# EAGLE design RFID_bmd200 (EAGLE 7.5.0)

## Sheet 1 of 2
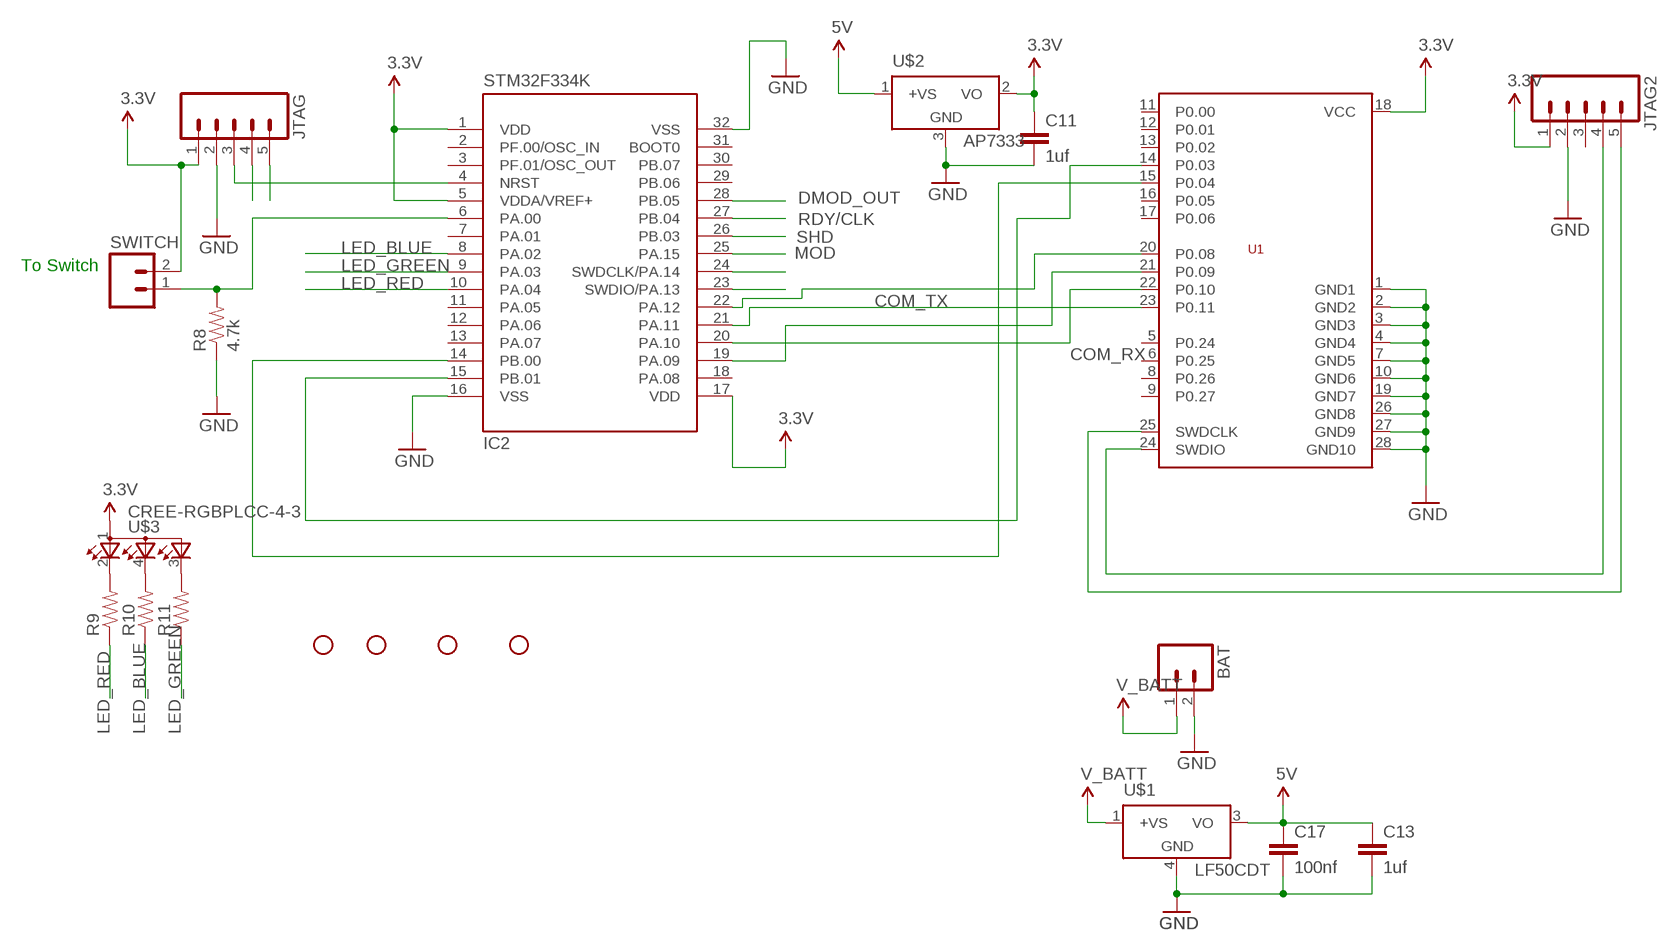
[diagram p0: schematic, sheet 1]

### Parts
BAT  M02PTH  [1X02]
C11  1uf  CAP0805  [0805]
C13  1uf  CAP0805  [0805]
C17  100nf  CAP0805  [0805]
IC2  STM32F334K  [LQFP-32]
JTAG  M05PTH  [1X05]
JTAG2  M05PTH  [1X05]
R8  4.7k  RESISTOR0805-RES  [0805]
R9  RESISTOR0805-RES  [0805]
R10  RESISTOR0805-RES  [0805]
R11  RESISTOR0805-RES  [0805]
STANDOFF1  STAND-OFF  [STAND-OFF]
STANDOFF2  STAND-OFF  [STAND-OFF]
STANDOFF3  STAND-OFF  [STAND-OFF]
STANDOFF4  STAND-OFF  [STAND-OFF]
SWITCH  M02PTH  [1X02]
U1  BMD-200  [BMD-200]
U$1  LF50CDT  [DPACK_3]
U$2  AP7333  [SOT23-3]
U$3  CREE-RGBPLCC-4-3  [P-LCC-4-3]

### Nets
3.3V: C11.1 IC2.1(VDD) IC2.5(VDDA/VREF+) IC2.17(VDD) JTAG2.1 JTAG.1 SWITCH.2 U1.18(VCC) U$2.2(VO) U$3.1(A2)
5V: C13.1 C17.1 U$1.3(VO) U$2.1(+VS) ; also sheet 2
COM_RX: IC2.20(PA.10) U1.22(P0.10)
COM_TX: IC2.19(PA.09) U1.21(P0.09)
DMOD_OUT: IC2.28(PB.05) ; also sheet 2
GND: BAT.2 C11.2 C13.2 C17.2 IC2.16(VSS) IC2.32(VSS) JTAG2.2 JTAG.2 R8.1 U1.1(GND1) U1.2(GND2) U1.3(GND3) U1.4(GND4) U1.7(GND5) U1.10(GND6) U1.19(GND7) U1.26(GND8) U1.27(GND9) U1.28(GND10) U$1.4(GND) U$2.3(GND) ; also sheet 2
LED_BLUE: IC2.8(PA.02) R10.1
LED_GREEN: IC2.9(PA.03) R11.1
LED_RED: IC2.10(PA.04) R9.1
MOD: IC2.25(PA.15) ; also sheet 2
N$3: IC2.6(PA.00) R8.2 SWITCH.1
N$4: IC2.22(PA.12) U1.20(P0.08)
N$8: IC2.21(PA.11) U1.23(P0.11)
N$16: IC2.15(PB.01) U1.14(P0.03)
N$17: JTAG2.5 U1.25(SWDCLK)
N$18: JTAG2.4 U1.24(SWDIO)
N$19: IC2.14(PB.00) U1.15(P0.04)
N$21: R9.2 U$3.2(CRED)
N$22: R10.2 U$3.4(CBLUE)
N$23: IC2.4(NRST) JTAG.3
N$26: R11.2 U$3.3(CGREEN)
RDY/CLK: IC2.27(PB.04) ; also sheet 2
SHD: IC2.26(PB.03) ; also sheet 2
STM_SWDCLK: IC2.24(SWDCLK/PA.14) JTAG.5
STM_SWDIO: IC2.23(SWDIO/PA.13) JTAG.4
V_BATT: BAT.1 U$1.1(+VS)
Unconnected: IC2.2(PF.00/OSC_IN) IC2.3(PF.01/OSC_OUT) IC2.7(PA.01) IC2.11(PA.05) IC2.12(PA.06) IC2.13(PA.07) IC2.18(PA.08) IC2.29(PB.06) IC2.30(PB.07) IC2.31(BOOT0) JTAG2.3 U1.5(P0.24) U1.6(P0.25) U1.8(P0.26) U1.9(P0.27) U1.11(P0.00) U1.12(P0.01) U1.13(P0.02) U1.16(P0.05) U1.17(P0.06)

### Notes on the sheet
- To Switch

## Sheet 2 of 2: RFid chip module
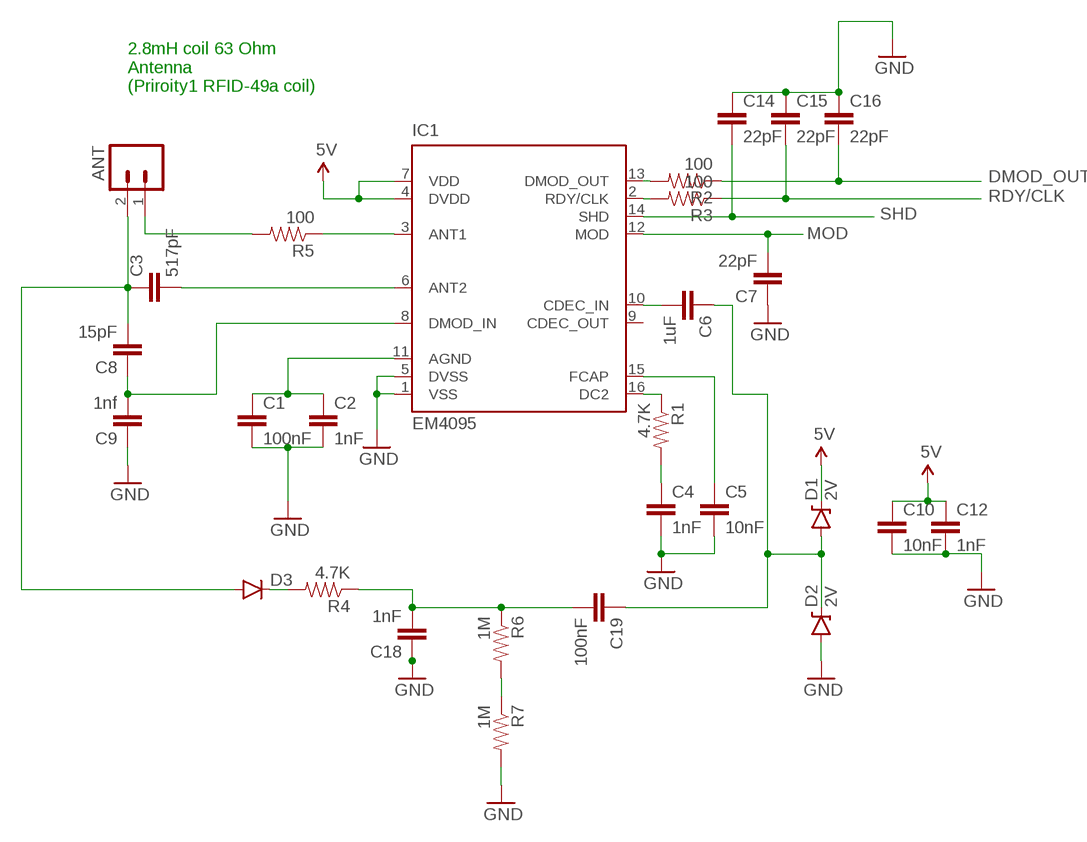
[diagram p1: schematic, sheet 2]

### Parts
ANT  M02PTH  [1X02]
C1  100nF  CAP0805  [0805]
C2  1nF  CAP0805  [0805]
C3  517pF  CAP0805  [0805]
C4  1nF  CAP0805  [0805]
C5  10nF  CAP0805  [0805]
C6  1uF  CAP0805  [0805]
C7  22pF  CAP0805  [0805]
C8  15pF  CAP0805  [0805]
C9  1nf  CAP0805  [0805]
C10  10nF  CAP0805  [0805]
C12  1nF  CAP0805  [0805]
C14  22pF  CAP0805  [0805]
C15  22pF  CAP0805  [0805]
C16  22pF  CAP0805  [0805]
C18  1nF  CAP0805  [0805]
C19  100nF  CAP  [C1812]
D1  2V  DIODE-ZENER16V  [SOD-123]
D2  2V  DIODE-ZENER16V  [SOD-123]
D3  DIODESMF  [SMF]
IC1  EM4095  [SO16]
R1  4.7K  RESISTOR0805-RES  [0805]
R2  100  RESISTOR0805-RES  [0805]
R3  100  RESISTOR0805-RES  [0805]
R4  4.7K  RESISTOR0805-RES  [0805]
R5  100  RESISTOR0805-RES  [0805]
R6  1M  RESISTOR0805-RES  [0805]
R7  1M  RESISTOR0805-RES  [0805]

### Nets
5V: C10.1 C12.1 D1.C IC1.4(DVDD) IC1.7(VDD) ; also sheet 1
ANT1: ANT.1 R5.2
DMOD_OUT: C16.2 R2.1 ; also sheet 1
GND: C1.2 C2.2 C4.2 C5.2 C7.1 C9.1 C10.2 C12.2 C14.1 C15.1 C16.1 C18.1 D2.A IC1.1(VSS) IC1.5(DVSS) R7.2 ; also sheet 1
MOD: C7.2 IC1.12(MOD) ; also sheet 1
N$1: IC1.13(DMOD_OUT) R2.2
N$2: IC1.2(RDY/CLK) R3.2
N$5: C6.2 IC1.10(CDEC_IN)
N$6: R6.2 R7.1
N$7: C5.1 IC1.15(FCAP)
N$9: C4.1 R1.2
N$10: IC1.16(DC2) R1.1
N$11: IC1.3(ANT1) R5.1
N$12: C3.2 IC1.6(ANT2)
N$13: ANT.2 C3.1 C8.2 D3.P$2(A)
N$14: C1.1 C2.1 IC1.11(AGND)
N$15: C8.1 C9.2 IC1.8(DMOD_IN)
N$24: C18.2 C19.2 R4.1 R6.1
N$25: C6.1 C19.1 D1.A D2.C
N$29: D3.P$1(C) R4.2
RDY/CLK: C15.2 R3.1 ; also sheet 1
SHD: C14.2 IC1.14(SHD) ; also sheet 1
Unconnected: IC1.9(CDEC_OUT)

### Notes on the sheet
- 2.8mH coil 63 Ohm
  Antenna
  (Priroity1 RFID-49a coil)

## Library data of the parts
ANT BAT SWITCH = SparkFun-Connectors:M02: Standard 2-pin 0.1" header. Use with - straight break away headers ( PRT-00116) - right angle break away headers (PRT-00553) - swiss pins (PRT-00743) - machine pins (PRT-00117) - female headers (PRT-00115) Molex polarized connector foot print use with: PRT-08233 with associated crimp pins and housings. 2.54_SCREWTERM for use with PRT-10571. 3.5mm Screw Terminal footprints for PRT-08084 5mm Screw Terminal footprints for use with PRT-08432
C1-C18 = SparkFun-Passives:CAP: Capacitor Standard 0603 ceramic capacitor, and 0.1" leaded capacitor.
C19 = User-Submitted:CAP
D1 D2 = SparkFun-DiscreteSemi:DIODE-ZENER: Zener Diode Production Part - 8199 3.4V Zener Voltage; PROD_ID: DIO-12440; VALUE: 16V
D3 = SparkFun-DiscreteSemi:DIODE: Diode These are standard reverse protection diodes and small signal diodes. SMA package can handle up to about 1A. SOD-323 can handle about 200mA. What the SOD-323 package when ordering, there are some mfgs out there that are 5-pin packages.
IC1 = em-microelectronic:EM4095: Read/Write analog front end for 125kHz RFID Basestation Source: http://www.emmicroelectronic.com/webfiles/Product/RFID/DS/EM4095_DS.pdf
IC2 = User-Submitted:STM32F334K: ST micro STM32F334K is a 72Mhz ARM Cortex-M4 with FPU
JTAG JTAG2 = SparkFun-Connectors:M05: Header 5 Standard 5-pin 0.1" header. Use with straight break away headers (SKU : PRT-00116), right angle break away headers (PRT-00553), swiss pins (PRT-00743), machine pins (PRT-00117), and female headers (PRT-00115). Molex polarized connector foot print use with SKU : PRT-08230 with associated crimp pins and housings.
R1-R11 = SparkFun-Passives:RESISTOR: Resistor Basic schematic elements and footprints for 0603, 1206, and PTH resistors.
STANDOFF1-STANDOFF4 = SparkFun-Electromechanical:STAND-OFF: #4 Stand Off This is the mechanical footprint for a #4 phillips button head screw. Use the keepout ring to avoid running the screw head into surrounding components. SKU : PRT-00447
U1 = BMD-200:BMD-200
U$1 = User-Submitted:LF50CDT
U$2 = User-Submitted:AP7333
U$3 = User-Submitted:CREE-RGB

## Board
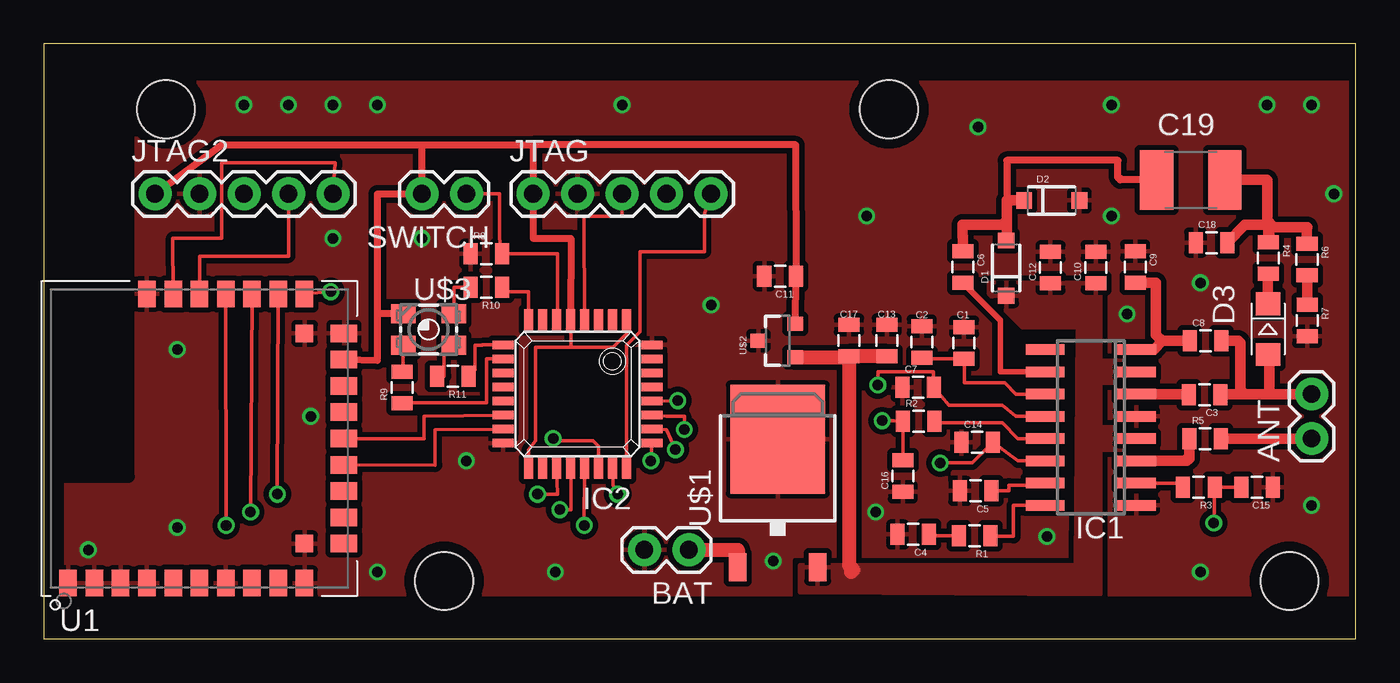
[diagram p2: board, top side]
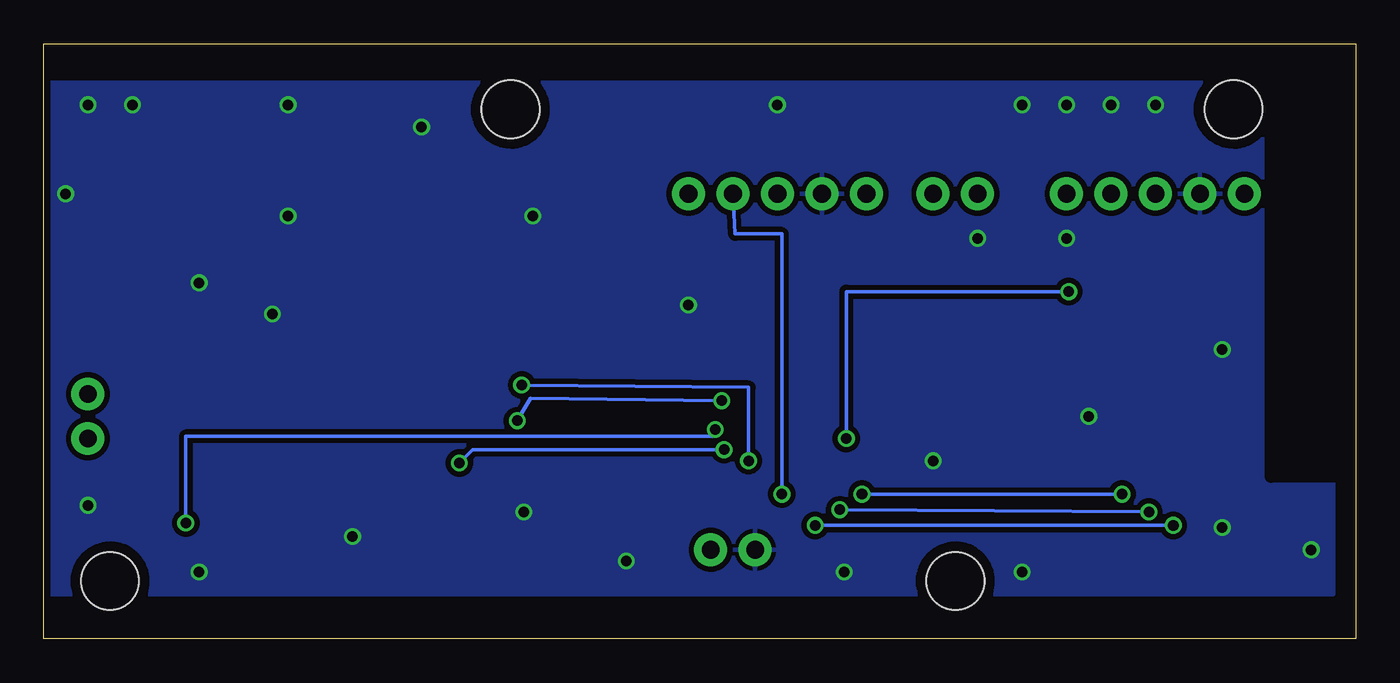
[diagram p3: board, bottom side, seen from below]

Size 74.91 x 33.96 mm. Coordinates in mm from the lower left corner, seen from the top.
Outline: 0,0 74.91,0 74.91,33.96 0,33.96 0,0
Copper layers (1*16): Top 0.0356mm / dielectric 1.5011mm / Bottom 0.0356mm
Design rules "LaenPCBOrder": minimum track width 6mil, minimum drill 13mil, track to track 6mil, track to pad 6mil, pad to pad 6mil, via to via 6mil, smd to smd 6mil, copper to edge 15mil, drill to drill 6mil, minimum pad ring 7mil, minimum via ring 7mil, stop-mask expansion 3mil, vias tented up to drill 0mil, thermal gap 10mil

### Footprints (pad centres in the part's own frame; a part is rotated, then mirrored left to right if it is on the bottom)
1X02 = drill 1.016 pad 1.88: 1 0,0; 2 2.54,0
0805 = smd 0.8 x 1.2: 1 -0.9,0; 2 0.9,0
C1812 = smd 1.9 x 3.4: 1 -1.95,0; 2 1.95,0
SOD-123 = smd 0.9 x 0.95: A 1.575,0; C -1.575,0
SMF = smd 1.3 x 1.4: P$1 -1.45,0; P$2 1.45,0
SO16 = smd 0.6 x 2.2: 1 -4.445,-2.6; 2 -3.175,-2.6; 3 -1.905,-2.6; 4 -0.635,-2.6; 5 0.635,-2.6; 6 1.905,-2.6; 7 3.175,-2.6; 8 4.445,-2.6; 9 4.445,2.6; 10 3.175,2.6; 11 1.905,2.6; 12 0.635,2.6; 13 -0.635,2.6; 14 -1.905,2.6; 15 -3.175,2.6; 16 -4.445,2.6
LQFP-32 = smd 0.5 x 1.2: 1 -2.8,-4.25; 2 -2,-4.25; 3 -1.2,-4.25; 4 -0.4,-4.25; 5 0.4,-4.25; 6 1.2,-4.25; 7 2,-4.25; 8 2.8,-4.25; 17 2.8,4.25; 18 2,4.25; 19 1.2,4.25; 20 0.4,4.25; 21 -0.4,4.25; 22 -1.2,4.25; 23 -2,4.25; 24 -2.8,4.25 | smd 1.2 x 0.5: 9 4.25,-2.8; 10 4.25,-2; 11 4.25,-1.2; 12 4.25,-0.4; 13 4.25,0.4; 14 4.25,1.2; 15 4.25,2; 16 4.25,2.8; 25 -4.25,2.8; 26 -4.25,2; 27 -4.25,1.2; 28 -4.25,0.4; 29 -4.25,-0.4; 30 -4.25,-1.2; 31 -4.25,-2; 32 -4.25,-2.8
1X05 = drill 1.016 pad 1.88: 1 0,0; 2 2.54,0; 3 5.08,0; 4 7.62,0; 5 10.16,0
STAND-OFF = hole 3.302: 0,0
BMD-200 = smd 1 x 1.5: 1 -7.5,-8.25; 2 -6,-8.25; 3 -4.5,-8.25; 4 -3,-8.25; 5 -1.5,-8.25; 6 0,-8.25; 7 1.5,-8.25; 8 3,-8.25; 9 4.5,-8.25; 10 6,-8.25; 20 6,8.25; 21 4.5,8.25; 22 3,8.25; 23 1.5,8.25; 24 0,8.25; 25 -1.5,8.25; 26 -3,8.25 | smd 1.5 x 1: 11 8.25,-6; 12 8.25,-4.5; 13 8.25,-3; 14 8.25,-1.5; 15 8.25,0; 16 8.25,1.5; 17 8.25,3; 18 8.25,4.5; 19 8.25,6 | smd 1 x 1: 27 6,-6; 28 6,6
DPACK_3 = smd 1 x 1.6: 1 -2.28,-4.8; 3 2.28,-4.8 | smd 5.4 x 6.2: 4 0,2.5
SOT23-3 = smd 0.8 x 0.9: 1 -0.95,-1; 2 0.95,-1; 3 0,1.1
P-LCC-4-3 = smd 1.1 x 1.4: 1 0.9,1.45; 2 -0.9,1.45; 3 -0.9,-1.45; 4 0.9,-1.45

### Placement (x,y rotation side)
ANT  72.39,11.43 90 top
BAT  36.83,5.08 180 top
C1  52.54,16.88 90 top
C2  50.13,16.94 90 top
C3  66.29,13.94 180 top
C4  49.65,5.96 180 top
C5  53.21,8.44 180 top
C6  52.47,21.22 270 top
C7  49.92,14.36 0 top
C8  66.34,17 0 top
C9  62.32,21.23 270 top
C10  60.06,21.2 90 top
C11  42.04,20.7 180 top
C12  57.49,21.19 90 top
C13  48.13,17.02 90 top
C14  53.3,11.21 0 top
C15  69.27,8.65 180 top
C16  49.05,9.28 90 top
C17  45.97,17.02 90 top
C18  66.67,22.61 0 top
C19  65.49,26.19 0 top
D1  54.95,21.16 90 top
D2  57.55,25.02 0 top
D3  69.9,17.68 270 top
IC1  59.78,12.06 90 top
IC2  30.48,13.97 180 top
JTAG  27.94,25.4 0 top
JTAG2  6.35,25.4 0 top
R1  53.15,5.88 180 top
R2  49.95,12.41 0 top
R3  65.95,8.65 180 top
R4  69.93,21.73 270 top
R5  66.31,11.43 0 top
R6  72.13,21.65 270 top
R7  72.14,18.16 270 top
R8  25.27,21.97 0 top
R9  20.45,14.35 90 top
R10  25.27,20.07 180 top
R11  23.37,14.99 180 top
STANDOFF1  48.26,30.23 0 top
STANDOFF2  71.12,3.3 0 top
STANDOFF3  6.99,30.23 0 top
STANDOFF4  22.86,3.3 0 top
SWITCH  24.13,25.4 180 top
U1  8.89,11.43 0 top
U$1  41.91,8.89 0 top
U$2  41.91,17.02 90 top
U$3  21.97,17.65 90 top

### Tracks (layer width: path | path; a pad name or v marks a point on that pad's centre or on a via)
3.3V
  Top 0.203: IC2.5 30.1,16.64 | IC2.17 27.69,10.79 28.07,11.3 28.07,16.64 30.1,16.64 | IC2.1 33.28,17.41 32.51,16.64 30.1,16.64
  Top 0.406: U$2.2 C11.1 42.93,28.19 27.94,28.19 | JTAG2.1 10.16,28.19 21.59,28.19 | 21.59,28.19 27.94,28.19 | 27.94,28.19 JTAG.1 27.94,22.86 30.1,22.86 IC2.5 | 21.59,28.19 SWITCH.2 19.05,25.4 19.05,18.55 | U1.18 19.05,15.88 19.05,18.55 | U$3.1 19.05,18.55
5V
  Top 0.813: 46.1,3.81 46.23,3.94 45.97,4.19 C17.1 | U$2.1 45.92,16.07 C17.1 | C13.1 C17.1
  pour Top (isolate 0.203): 43.69,2.67 60.33,2.54 60.33,10.79 61.59,10.79 61.59,12.06 60.33,12.06 60.33,14.61 61.59,14.61 61.59,15.88 60.33,15.88 60.33,20.32 53.98,20.32 53.98,19.68 55.88,17.78 59.05,17.78 58.93,4.19 43.18,4.19 43.18,2.67
ANT1
  Top 0.61: R5.2 ANT.1
COM_RX  (via drill 0.6)
  Top 0.203: IC2.20 30.1,8.64 30.1,7.37 v29.46,7.37 | v11.81,7.24 U1.22
  Bottom 0.203: v29.46,7.37 v11.81,7.24
COM_TX  (via drill 0.6)
  Top 0.203: IC2.19 29.34,8.26 v28.19,8.26 | v13.34,8.26 U1.21
  Bottom 0.203: v28.19,8.26 v13.34,8.26
DMOD_OUT  (via drill 0.6)
  Top 0.203: C16.2 R2.1 48.51,12.45 v47.88,12.45 | IC2.28 v36.2,13.59
  Bottom 0.203: v36.2,13.59 47.12,13.72 v47.88,12.45
GND  (via drill 0.6)
  other vias: 2.54,5.08 11.43,30.48 13.97,30.48 16.51,30.48 19.05,30.48 16.51,22.86 21.59,22.86 33.02,30.48 38.1,19.05 46.99,24.13 53.34,29.21 60.96,30.48 69.85,30.48 72.39,30.48 73.66,25.4 72.39,7.62 66.04,3.81 41.66,4.45 29.21,3.81 7.62,16.51 7.62,6.35 24.13,10.16 19.05,3.81 15.24,12.7 60.96,24.13 66.04,20.32 61.85,18.54 47.5,7.24 57.28,5.84
  pour Top (isolate 0.305, rank 2): 74.93,31.75 74.93,2.54 1.27,2.54 1.27,31.75
  pour Bottom (isolate 0.305, rank 2): 1.27,31.75 1.27,2.54 74.93,2.54 74.93,31.75
LED_BLUE
  Top 0.203: IC2.8 27.69,19.81 26.17,19.81 R10.1
LED_GREEN
  Top 0.203: IC2.9 25.02,16.77 25.02,16.76 24.64,16.76 24.64,15.37 24.27,15.37 R11.1
LED_RED
  Top 0.203: 20.45,13.57 R9.1 20.45,13.46 25.27,13.46 25.27,15.97 IC2.10
MOD  (via drill 0.6)
  Top 0.203: IC1.12 55.5,12.7 54.74,13.33 51.69,13.33 C7.2 50.8,15.24 47.62,15.24 v47.62,14.48 | IC2.25 v34.67,10.16
  Bottom 0.203: v34.67,10.16 34.67,14.35 v47.62,14.48
N$1
  Top 0.203: IC1.13 55.63,11.43 54.74,12.32 50.94,12.32 R2.2
N$2
  Top 0.203: IC1.2 64.82,8.89 R3.2
N$3
  Top 0.203: SWITCH.1 26.04,25.4 26.04,22.86 R8.2 29.34,21.97 29.34,18.92 IC2.6
N$4  (via drill 0.6)
  Top 0.203: v16.38,19.81 U1.20 | IC2.22 31.68,10.99 31.37,11.3 29.21,11.3 v29.08,11.43
  Bottom 0.203: v29.08,11.43 29.08,19.81 v16.38,19.81
N$5
  Top 0.305: IC1.10 54.61,15.24 54.61,18.18 C6.2
N$6
  Top 0.61: R7.1 R6.2
N$7
  Top 0.203: C5.1 55.12,8.44 55.12,8.76 57.19,8.76 IC1.15
N$8  (via drill 0.6)
  Top 0.203: IC2.21 v30.86,6.48 | v10.41,6.48 U1.23
  Bottom 0.203: v30.86,6.48 v10.41,6.48
N$9
  Top 0.203: R1.2 50.55,5.88 C4.1
N$10
  Top 0.203: IC1.16 55.37,7.62 55.37,5.84 54.05,5.84 R1.1
N$11
  Top 0.61: IC1.3 65.28,10.16 65.28,10.29 65.41,10.29 R5.1
N$12
  Top 0.61: IC1.6 65.36,13.97 C3.2
N$13
  Top 0.61: ANT.2 69.98,13.97 | 69.98,13.97 68.58,13.97 | 68.58,13.97 67.19,13.97 C3.1 | D3.P$2 69.98,16.23 69.98,13.97 | C8.2 68.22,17 68.33,16.89 68.33,14.22 68.58,13.97
N$14
  Top 0.203: IC1.11 55.5,13.97 54.86,14.61 52.58,14.61 52.58,15.94 C1.1 50.19,15.98 C2.1
N$15
  Top 0.61: C8.1 63.86,17 | 63.86,17 63.37,16.51 IC1.8 | C9.2 63.49,20.33 63.5,20.32 63.5,17.36 63.86,17
N$16
  Top 0.203: U1.14 22.35,9.91 22.35,11.94 IC2.15
N$17
  Top 0.203: U1.25 7.37,22.86 10.16,22.86 10.16,27.18 16.64,27.18 JTAG2.5
N$18
  Top 0.203: U1.24 8.89,21.84 13.97,21.84 JTAG2.4
N$19
  Top 0.203: U1.15 21.72,11.43 21.72,12.7 IC2.14
N$21
  Top 0.203: R9.2 20.52,15.25 U$3.2
N$22
  Top 0.203: R10.2 23.42,20.07 U$3.4
N$23
  Top 0.203: JTAG.3 33.02,24.13 30.86,24.13 IC2.4
N$24
  Top 0.61: R6.1 72.13,23.49 72.14,23.5 70.23,23.5 | 70.23,23.5 70.1,23.5 69.98,23.37 69.98,22.68 R4.1 69.93,23.54 69.85,23.62 68.58,23.62 C18.2 | C19.2 69.82,26.19 69.85,26.16 69.85,23.88 70.23,23.5
N$25
  Top 0.406: C19.1 61.47,26.19 61.47,26.29 61.34,26.29 61.34,27.3 54.99,27.3 54.99,24.51
  Top 0.61: D2.C 54.99,25.02 54.99,24.51 54.99,23.88 | 54.99,23.88 54.99,22.77 D1.A | C6.1 52.47,22.96 52.45,22.99 52.45,23.62 54.74,23.62 54.99,23.88
N$26
  Top 0.203: R11.2 22.86,14.99 22.86,16.51 23.42,16.51 U$3.3
N$29
  Top 0.61: D3.P$1 69.9,20.8 R4.2
RDY/CLK  (via drill 0.6)
  Top 0.203: C15.2 R3.1 v66.8,6.6 | IC2.27 35.56,12.7 36.58,12.7 v36.58,11.94
  Bottom 0.203: v36.58,11.94 36.58,11.56 66.8,11.56 v66.8,6.6
SHD  (via drill 0.6)
  Top 0.203: IC1.14 55.63,10.16 C14.2 53.02,10.03 v51.18,10.03 | IC2.26 35.56,11.94 v36.07,10.79
  Bottom 0.203: v36.07,10.79 50.42,10.79 v51.18,10.03
STM_SWDCLK
  Top 0.203: JTAG.5 37.72,24.26 37.72,22.1 34.04,22.1 34.04,17.53 33.27,16.76 33.27,16 IC2.24
STM_SWDIO  (via drill 0.6)
  Top 0.203: IC2.23 32.51,8.76 v32.77,8.26
  Bottom 0.203: v32.77,8.26 32.77,23.11 35.43,23.11 JTAG.4
V_BATT
  Top 0.813: BAT.1 39.62,5.08 U$1.1